# Altium schematic sheet WL-GENERATOR.SchDoc
size 420 x 297 mm; Address1: Address1; Address2: Address2; Address3: Address3; Address4: Address4; DocumentNumber: ТРАНСИВЕР «ВОЛК»; SheetNumber: 7; Scale: 1:1; DocumentType: Схема электрическая принципиальная; FirstReferrence: АБВГ.123456.001
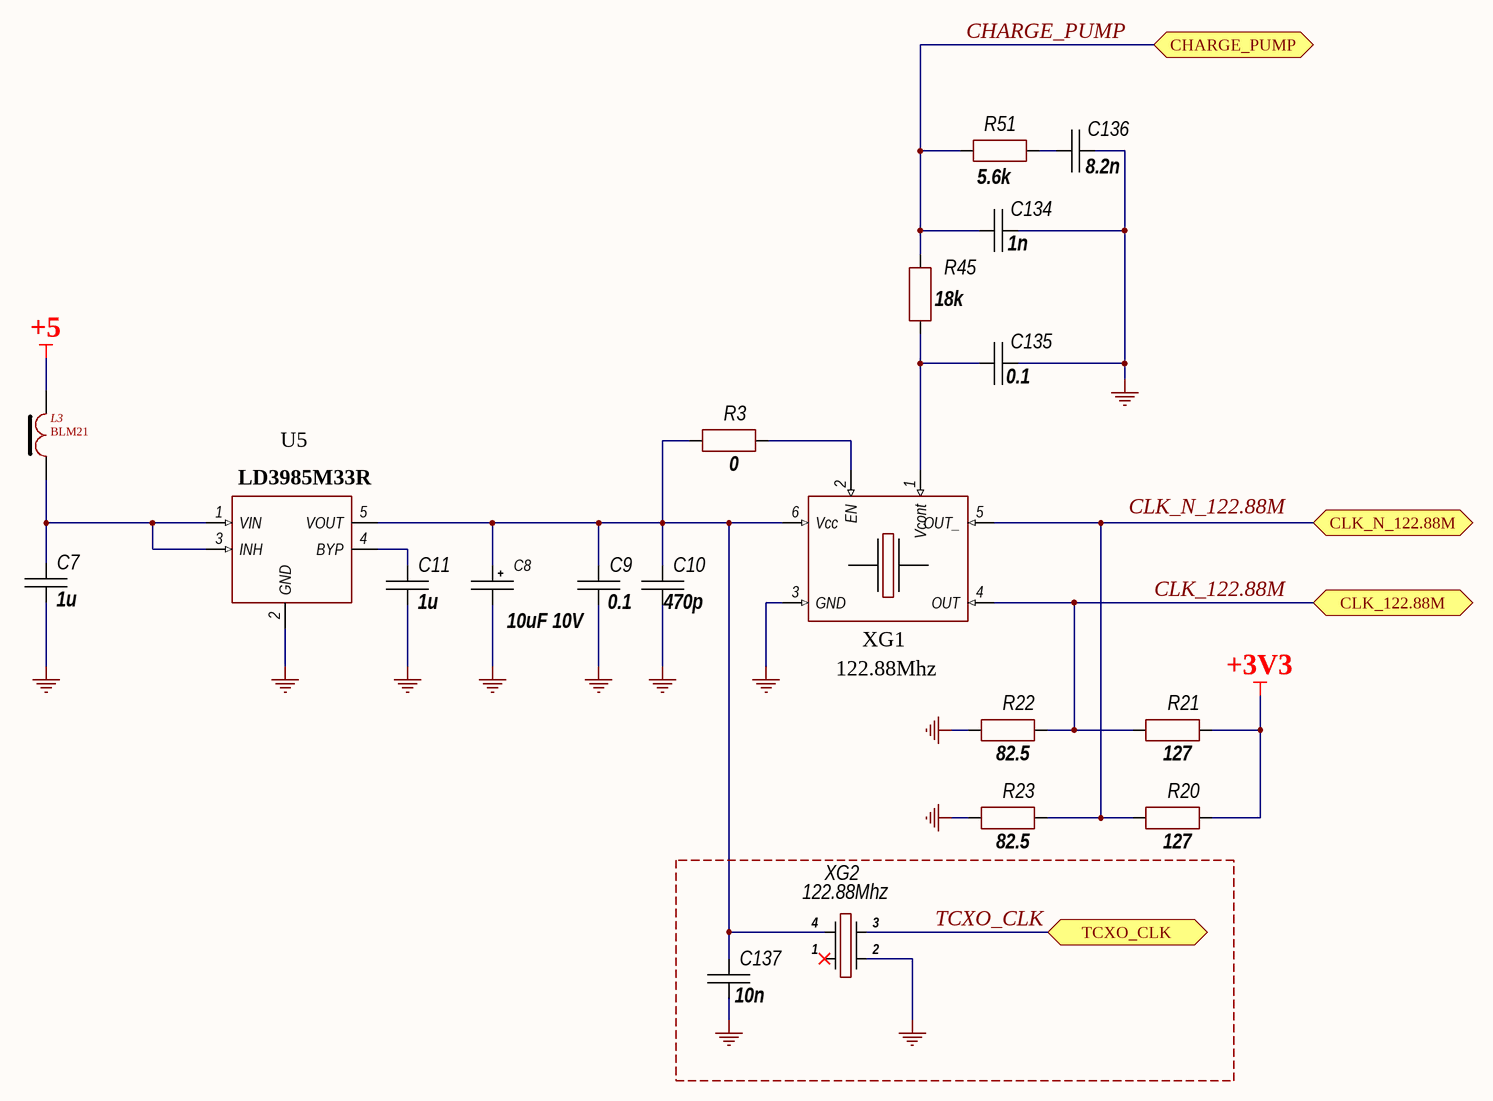
[diagram p0: WL-GENERATOR.SchDoc]

## Parts
C7  1u  [CH0805C]
C8  10uF 10V  [TANTAL_B]
C9  0.1  [CH0805C]
C10  470p  [CH0805C]
C11  1u  [CH0805C]
C134  1n  [CH0805C]
C135  0.1  [CH0805C]
C136  8.2n  [CH0805C]
C137  10n  [CH0805C]
L3  BLM21  [CH0805L]
R3  0  [CH0805R]
R20  127  [CH0805R]
R21  127  [CH0805R]
R22  82.5  [CH0805R]
R23  82.5  [CH0805R]
R45  18k  [CH0805R]
R51  5.6k  [CH0805R]
U5  LD3985M33R  [SOT23-5]
XG1  122.88Mhz
XG2  122.88Mhz  [OSC: 5070]

## Ports
CHARGE_PUMP (bidir), CLK_122.88M (bidir), CLK_N_122.88M (bidir), TCXO_CLK (bidir)

## Nets
+3V3: R20.1 R21.1
+5: L3.1
GND: C7.2 C8.2 C9.2 C10.2 C11.2 C134.2 C135.2 C136.2 C137.2 R22.2 R23.2 U5.2(GND) XG1.3(GND) XG2.2
CHARGE_PUMP: C134.1 R45.1 R51.1 ; port CHARGE_PUMP
CLK_122.88M: R21.2 R22.1 XG1.4(OUT) ; port CLK_122.88M
CLK_N_122.88M: R20.2 R23.1 XG1.5(OUT_) ; port CLK_N_122.88M
TCXO_CLK: XG2.3 ; port TCXO_CLK
NetC7_1: C7.1 L3.2 U5.1(VIN) U5.3(INH)
NetC8_1: C8.1 C9.1 C10.1 C137.1 R3.2 U5.5(VOUT) XG1.6(Vcc) XG2.4
NetC11_1: C11.1 U5.4(BYP)
NetC135_1: C135.1 R45.2 XG1.1(Vcont)
NetC136_1: C136.1 R51.2
NetR3_1: R3.1 XG1.2(EN)

Not connected (* = marked no-connect by the designer): XG2 1*

## Notes on the sheet
- Labels drawn without touching a wire or pin: CLK_N_122.88M
- Подп. и дата
- Инв. № дубл.
- Взам. инв. №
- Инв. № подл.
- Изм.
- Лист
- № докум.
- Подп.
- Дата
- 2.106-A3
- Копировал
- Формат А3

## Library data of the parts
C7 C9-C11 C134-C137 = Capacitor: Manufacturer: *; Model: *; HelpURL: *; ComponentKind: *; Value: *
C8 = TantalCap: Manufacturer: *; Model: *; HelpURL: *; ComponentKind: *; Value: *
L3 = FB-1
R3 R20-R23 R45 R51 = Resistor: Manufacturer: *; Model: *; HelpURL: *; ComponentKind: *; Value: *
U5 = LD3985M33R_SOT23
XG1 XG2 = Generator
  XG2: Manufacturer: *; Model: *; HelpURL: *; ComponentKind: *; Value: *